# EAGLE design ESP_IRInterface (EAGLE 8.4.1)
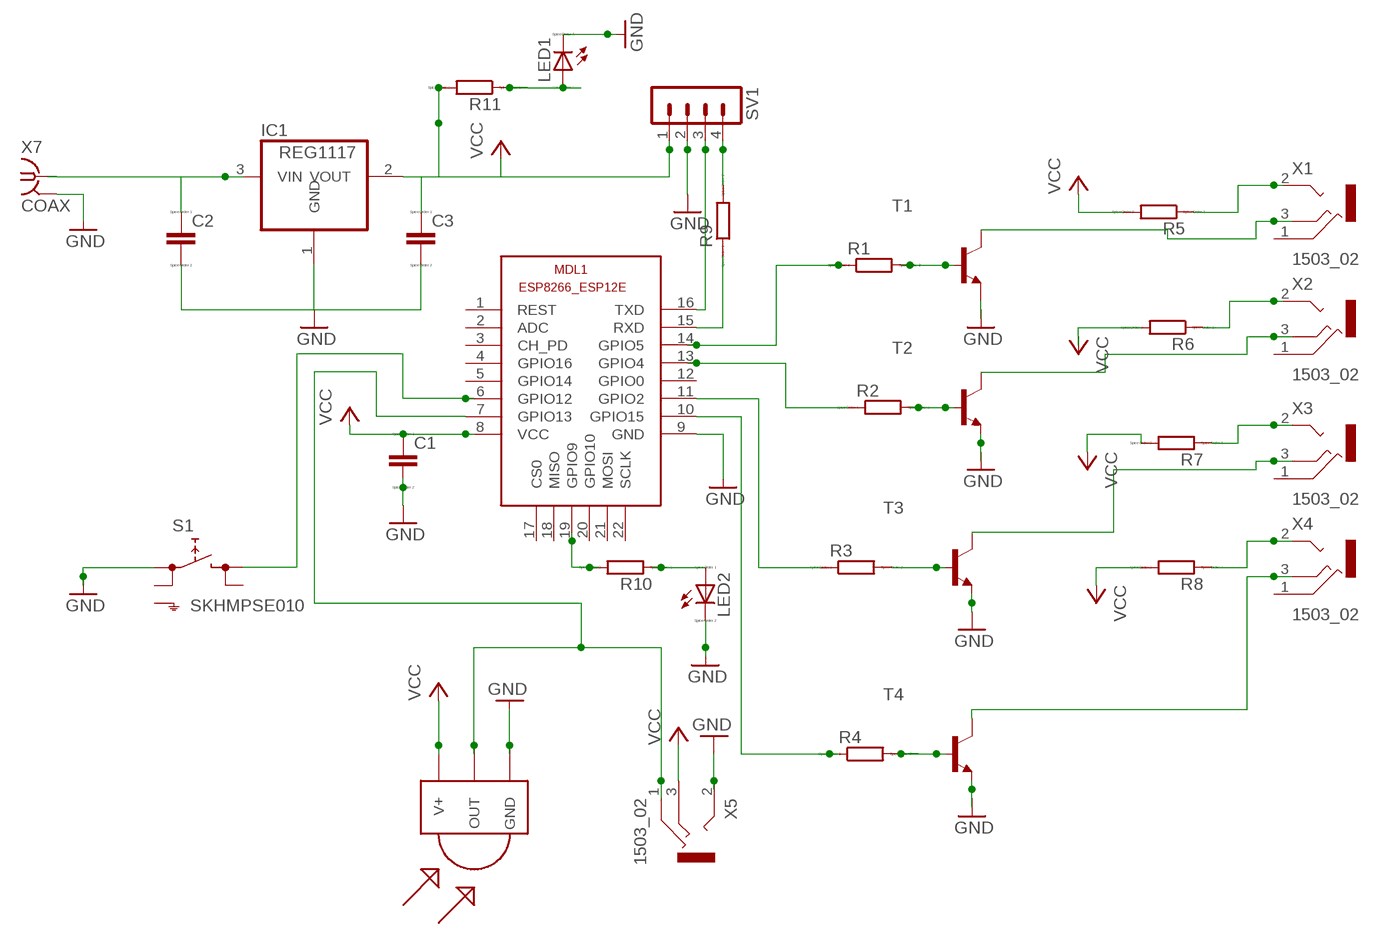
[diagram p0: schematic, sheet 1]

## Parts
C1  CC1206  [C1206]
C2  CC1206  [C1206]
C3  CC1206  [C1206]
IC1  REG1117  [SOT223]
LED1  LED_E  [LED_1206]
LED2  LED_E  [LED_1206]
MDL1  ESP8266-12EESP8266-ESP12E  [ESP8266-ESP12E]
R1  RR1206  [R1206]
R2  RR1206  [R1206]
R3  RR1206  [R1206]
R4  RR1206  [R1206]
R5  RR1206  [R1206]
R6  RR1206  [R1206]
R7  RR1206  [R1206]
R8  RR1206  [R1206]
R9  RR1206  [R1206]
R10  RR1206  [R1206]
R11  RR1206  [R1206]
S1  SKHMPSE010  [SKHMPXE010]
SV1  MA04-1  [MA04-1]
T1  MMBT2222ALT1-NPN-SOT23-BEC  [SOT23-BEC]
T2  MMBT2222ALT1-NPN-SOT23-BEC  [SOT23-BEC]
T3  MMBT2222ALT1-NPN-SOT23-BEC  [SOT23-BEC]
T4  MMBT2222ALT1-NPN-SOT23-BEC  [SOT23-BEC]
TSOP1  TSOP1730  [TSOP17XX]
X1  1503_02  [1503_02]
X2  1503_02  [1503_02]
X3  1503_02  [1503_02]
X4  1503_02  [1503_02]
X5  1503_02  [1503_02]
X7  COAX  [MMCX-J-P-X-ST-EM1-MKT]

## Nets
GND: C1.2 LED1.C LED2.C S1.1(1.1) SV1.2 T2.E T3.E X5.2
N$1: C2.2 C3.2 IC1.1(GND)
N$2: X7.2@1(GND)
N$3: MDL1.9(GND)
N$4: T1.E
N$5: T4.E
N$6: TSOP1.GND
N$7: MDL1.7(GPIO13) TSOP1.OUT X5.1
N$8: MDL1.15(RXD) R9.1
N$9: MDL1.10(GPIO15) R4.1
N$10: MDL1.11(GPIO2) R3.1
N$11: MDL1.13(GPIO4) R2.1
N$12: MDL1.14(GPIO5) R1.1
N$13: R1.2 T1.B
N$14: R2.2 T2.B
N$15: R3.2 T3.B
N$16: R4.2 T4.B
N$17: R5.1 X1.2
N$18: R6.1 X2.2
N$19: R7.1 X3.2 X3.2@2
N$20: R8.1 X4.2 X4.2@2
N$21: T1.C X1.3
N$22: T2.C X2.3
N$23: T3.C X3.3
N$24: T4.C X4.3
N$26: C2.1 IC1.3(VIN)
N$27: R9.2 SV1.4
N$28: MDL1.16(TXD) SV1.3
N$109: LED1.A R11.1
N$110: MDL1.6(GPIO12) S1.3(2.1)
N$111: MDL1.19(GPIO9) R10.2
N$112: LED2.A R10.1
VCC: C1.1 C3.1 IC1.2(VOUT) MDL1.8(VCC) R5.2 R7.2 R8.2 R11.2 SV1.1 TSOP1.V+ X5.3
Unconnected: MDL1.1(REST) MDL1.2(ADC) MDL1.3(CH_PD) MDL1.4(GPIO16) MDL1.5(GPIO14) MDL1.12(GPIO0) MDL1.17(CS0) MDL1.18(MISO) MDL1.20(GPIO10) MDL1.21(MOSI) MDL1.22(SCLK) R6.2 S1.2(1.2) S1.4(2.2) S1.5(SH) X1.1 X1.2@2 X2.1 X2.2@2 X3.1 X4.1 X5.2@2 X7.1

## Power pins joined to a net without a drawn wire
GND: X7.2@2(GND) X7.2@3(GND) X7.2@4(GND)

## Library data of the parts
C1-C3 = eagle-ltspice:C: CAPACITOR, European symbol; SPICEMODEL: NONE; SPICEPREFIX: C
IC1 = burr-brown:REG1117: 800mA and 1A Low Dropout (LDO) Positive Regulator 1.8V, 2.5V, 2.85V, 3.3V, 5V, and Adj; MPN: REG1117; OC_FARNELL: 1097566; OC_NEWARK: 14P6981
LED1 LED2 = eagle-ltspice:LED_E: LED Source: http://www.osram.convergy.de Source: www.luxeon.com Source: www.kingbright.com; SPICEMODEL: NONE; SPICEPREFIX: D; SPICETYPE: diode
MDL1 = ESP8266-ESP12E:ESP8266-12E: ESP8266-12E with additional I/O and GPIO04/05 corrected The author cannot warrant that this library is free from error or will meet your specific requirements. Created by PuceBaboon.com. Komagane, Nagano, JAPAN
R1-R11 = eagle-ltspice:R: RESISTOR, European symbol; SPICEMODEL: NONE; SPICEPREFIX: R
S1 = switch:SKHMP*E010: 6.2 X 6.5mm TACT Switch (SMD) Source: http://www3.alps.co.jp/WebObjects/catalog.woa/PDF/E/Switch/Tact/SKHM/SKHM.PDF
SV1 = con-lstb:MA04-1: PIN HEADER; OC_FARNELL: unknown; OC_NEWARK: unknown
T1-T4 = transistor:*-NPN-: NPN Transistror BF959 corrected 2008.03.06
TSOP1 = tsop:TSOP1730: IR Receiver and Demodulator
X1-X5 = con-lumberg:1503_02: Jack connectors according to JISC 6560, 3.5 mm Klinkeneinbaukupplung nach JISC 6560, 3,5 mm, 3-polig/stereo, abgewinkelte Ausführung, Surface-Mount-Technik (SMT) Source: http://www.lumberg.com/Produkte/PDFs/1503_02.pdf; OC_FARNELL: 1216979; OC_NEWARK: unknown
X7 = con-samtec:COAX: MMCX STRAIGHT, EDGE MOUNT JACK- 50 OHM Source: http://www.samtec.com/ftppub/cpdf/MMCX-J-P-X-ST-EM1-MKT.pdf; OC_FARNELL: unknown; OC_NEWARK: unknown

## Board
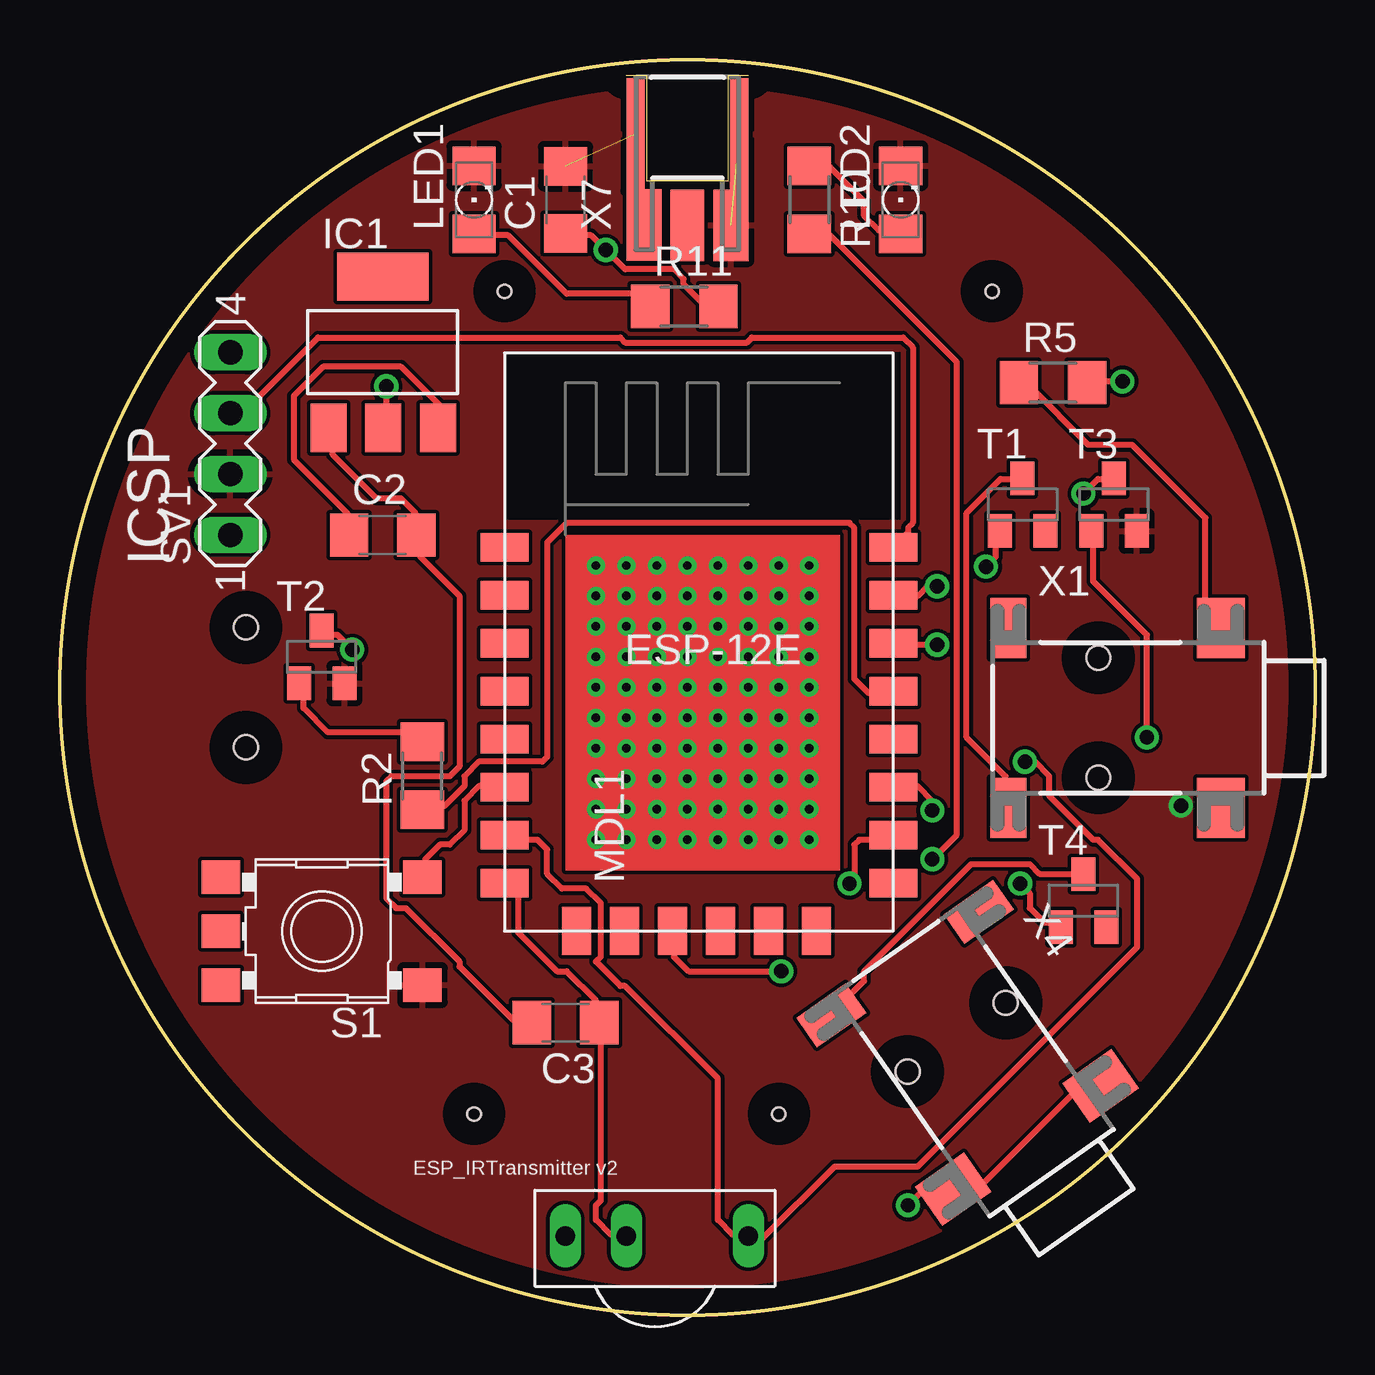
[diagram p1: board, top side]
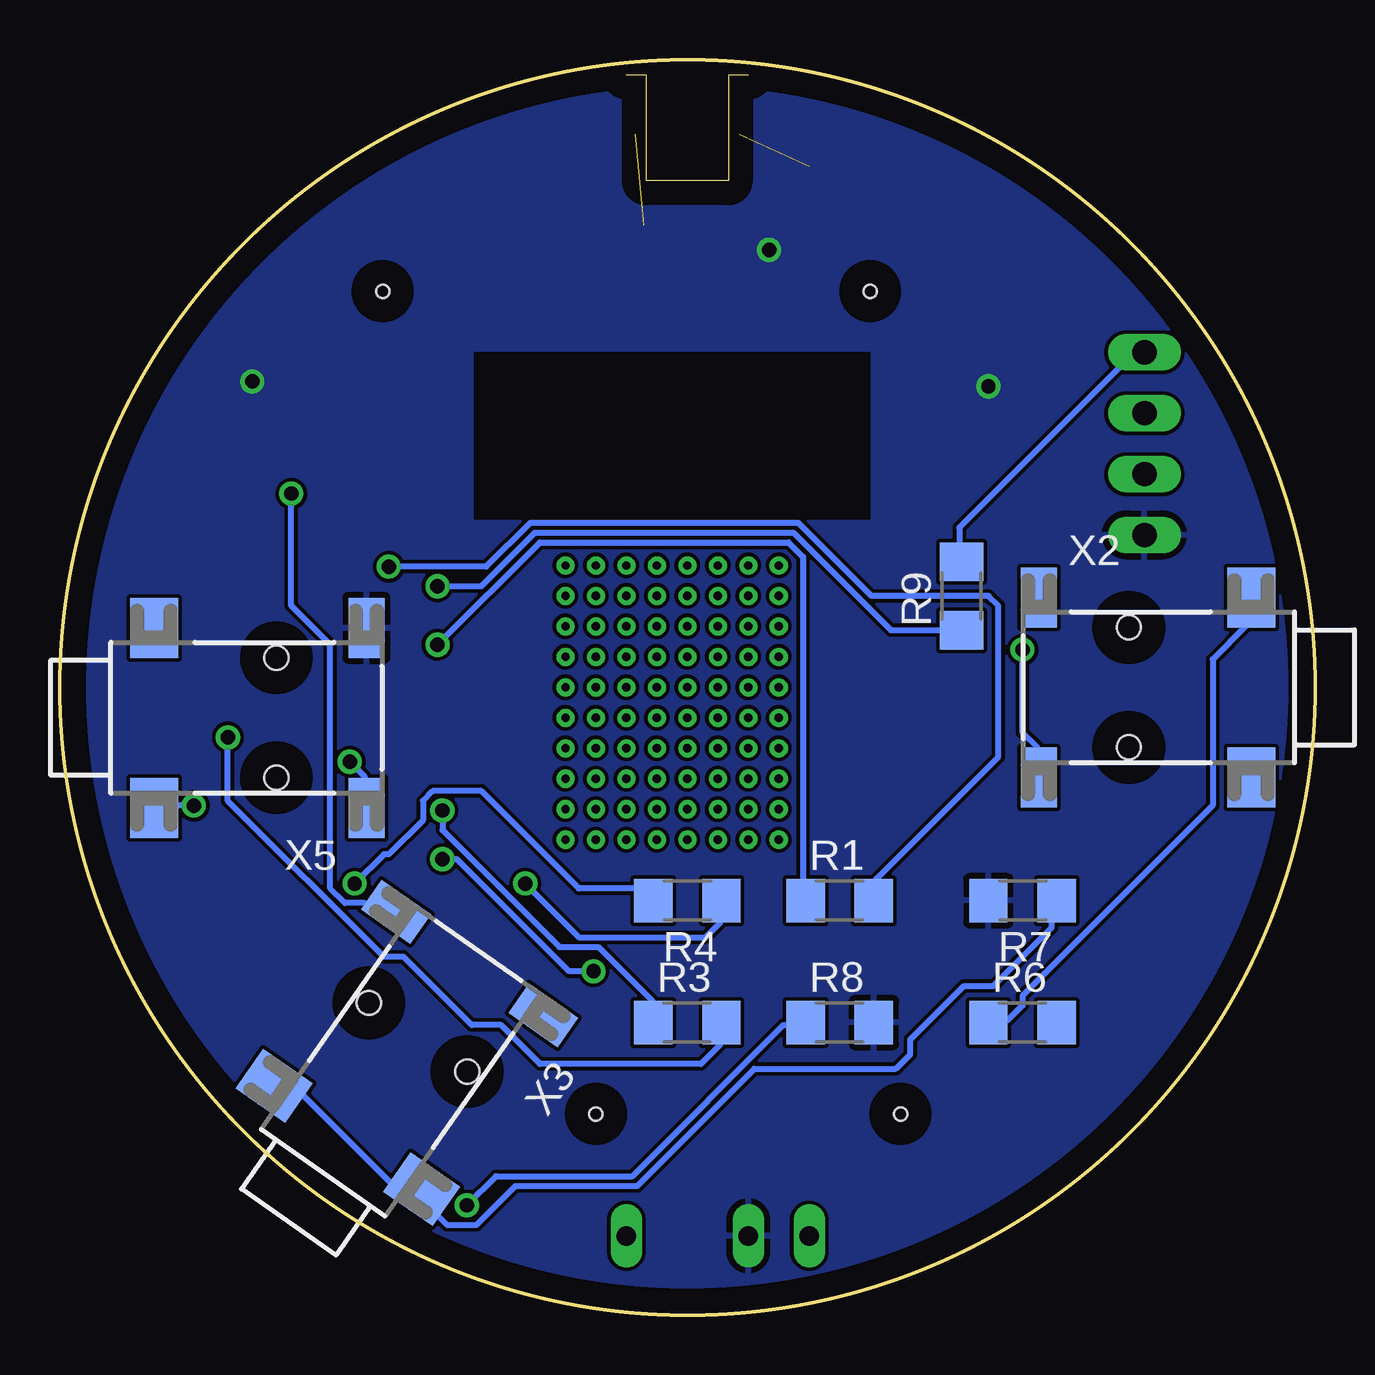
[diagram p2: board, bottom side, seen from below]

Size 52.3 x 52.3 mm. Coordinates in mm from the lower left corner, seen from the top.
Outline: circle at 26.15,26.15 radius 26.15
Copper layers (1*16): Top 0.035mm / dielectric 1.5mm / Bottom 0.035mm
Design rules "default *": minimum track width 10mil, minimum drill 0.6mm, track to track 6mil, track to pad 6mil, pad to pad 6mil, via to via 6mil, smd to smd 6mil, copper to edge 40mil, drill to drill 6mil, minimum pad ring 10mil, minimum via ring 8mil, stop-mask expansion 4mil, vias tented up to drill 0mil, thermal gap 10mil
Holes 0.55 mm at 18.53,42.66 38.85,42.66 17.26,8.37 29.96,8.37
tKeepout: area 21.1,18.5 to 32.5,32.5
tRestrict: area 21.1,18.5 to 32.5,32.5; area 21.1,18.5 to 32.5,32.5

### Footprints (pad centres in the part's own frame; a part is rotated, then mirrored left to right if it is on the bottom)
C1206 = smd 1.6 x 1.8: 1 -1.4,0; 2 1.4,0
SOT223 = smd 1.499 x 2.007: 1 -2.261,-3.15; 2 0.025,-3.15; 3 2.311,-3.15 | smd 3.81 x 2.007: 4 0,3.15
LED_1206 = smd 1.6 x 1.803: A -1.422,0; C 1.422,0
ESP8266-ESP12E = smd 2 x 1.2: 1 -7.62,5.84; 2 -7.62,3.84; 3 -7.62,1.84; 4 -7.62,-0.16; 5 -7.62,-2.16; 6 -7.62,-4.16; 7 -7.62,-6.16; 8 -7.62,-8.16; 9 8.58,-8.16; 10 8.58,-6.16; 11 8.58,-4.16; 12 8.58,-2.16; 13 8.58,-0.16; 14 8.58,1.84; 15 8.58,3.84; 16 8.58,5.84 | smd 1.2 x 2: 17 -4.62,-10.16; 18 -2.62,-10.16; 19 -0.62,-10.16; 20 1.38,-10.16; 21 3.38,-10.16; 22 5.38,-10.16
R1206 = smd 1.6 x 1.803: 1 -1.422,0; 2 1.422,0
SKHMPXE010 = smd 1.6 x 1.4: 1 -4.2,2.25; 2 4.2,2.25; 3 -4.2,-2.25; 4 4.2,-2.25; 5 4.2,0
MA04-1 = drill 1.016 long: 1 -3.81,0; 2 -1.27,0; 3 1.27,0; 4 3.81,0
SOT23-BEC = smd 1 x 1.4: B -0.95,-1.1; C 0,1.1; E 0.95,-1.1
TSOP17XX = drill 0.813 long: GND -3.81,0; OUT 3.81,0; V+ -1.27,0
1503_02 = smd 2.5 x 1.5: 1 -3.75,-10.75; 3 3.75,-10.75 | smd 2.5 x 2: 2 -3.75,-1.9; 2@2 3.75,-1.9 | hole 1: -2.5,-7; 2.5,-7
MMCX-J-P-X-ST-EM1-MKT = smd 1.4 x 2.975: 1 0,-6.15 | smd 1.46 x 2.975: 2@1 -1.812,-6.125; 2@2 1.812,-6.138 | smd 0.76 x 4.7: 2@3 -2.163,-2.35; 2@4 2.163,-2.35

### Placement (x,y rotation side)
C1  21.07,46.47 90 top
C2  13.45,32.5 0 top
C3  21.07,12.18 180 top
IC1  13.45,40.12 0 top
LED1  17.26,46.47 90 top
LED2  35.04,46.47 90 top
MDL1  26.15,26.15 0 top
R1  19.8,17.26 0 bottom
R2  15.1,22.47 90 top
R3  26.15,12.18 0 bottom
R4  26.15,17.26 180 bottom
R5  41.39,38.85 0 top
R6  12.18,12.18 0 bottom
R7  12.18,17.26 180 bottom
R8  19.8,12.18 0 bottom
R9  14.72,29.96 90 bottom
R10  31.23,46.47 270 top
R11  26.02,42.03 0 top
S1  10.91,15.99 180 top
SV1  7.1,36.31 90 top
T1  40.12,33.77 0 top
T2  10.91,27.42 0 top
T3  43.93,33.77 0 top
T4  42.66,17.26 0 top
TSOP1  24.88,3.29 0 top
X1  50.28,24.88 270 top
X2  0.75,26.15 270 bottom
X3  41.39,5.83 145 bottom
X4  41.39,5.83 215 top
X5  50.28,24.88 90 bottom
X7  26.15,51.55 0 top

### Tracks (layer width: path | path; a pad name or v marks a point on that pad's centre or on a via)
GND  (via drill 0.6)  (2 unrouted)
  Bottom 0.254: v46.72,21.22 48.35,21.22 X5.2
  pour Top: -15.76,64.25 74.41,64.25 74.41,-17.03 -15.76,-17.03
N$1
  Top 0.254: C3.2 19.5,12.28 18.89,12.28 16.65,14.52 16.65,14.72 14.42,16.96 14.01,16.96 13.6,17.36 13.6,22.24 13.81,22.44 16.24,22.44 16.65,22.85 16.65,29.96 15.03,31.59 15.03,32.4 C2.2 14.82,32.6 14.82,33.41 14.21,34.02 13.2,34.02 11.37,35.85 11.37,36.87 IC1.1
N$7  (via drill 0.6)
  Top 0.254: MDL1.7 18.68,19.8 19.9,19.8 20.31,19.39 20.31,18.38 20.92,17.77 21.93,17.77 22.54,17.16 22.54,14.92 22.34,14.72 23.36,13.7 23.56,13.7 27.42,9.84 27.42,3.95 28.03,3.34 28.64,3.34 TSOP1.OUT 28.84,3.14 29.25,3.14 32.3,6.19 35.75,6.19 44.9,15.33 44.9,18.17 43.27,19.8 43.07,19.8 41.24,21.63 41.24,22.44 40.63,23.05 v40.22,23.05
  Bottom 0.254: v40.22,23.05 39.61,22.44 39.61,21.22 X5.1
N$8  (via drill 0.6)
  Top 0.254: v36.56,30.37 36.16,30.37 35.75,29.96 34.74,29.96 MDL1.15
  Bottom 0.254: v36.56,30.37 34.74,30.37 32.5,32.6 21.73,32.6 17.67,28.54 14.82,28.54 R9.1
N$9  (via drill 0.6)
  Top 0.254: v32.91,17.97 33.11,18.17 33.11,19.6 33.31,19.8 34.53,19.8 MDL1.10
  Bottom 0.254: v32.91,17.97 30.67,15.74 25.39,15.74 24.78,16.35 24.78,17.16 R4.1
N$10  (via drill 0.6)
  Top 0.254: v36.36,21.02 36.36,21.43 35.75,22.04 34.74,22.04 MDL1.11
  Bottom 0.254: v36.36,21.02 36.36,20.21 31.48,15.33 29.86,15.33 27.62,13.09 27.62,12.28 R3.1
N$11
  Top 0.254: R2.1 15.23,21.22 16.04,21.22 16.85,22.04 16.85,22.44 17.46,23.05 20.11,23.05 20.31,23.25 20.31,32.2 21.12,33.01 32.91,33.01 33.11,32.81 33.11,26.51 33.72,25.9 34.53,25.9 MDL1.13
N$12  (via drill 0.6)
  Top 0.254: v36.56,27.93 34.74,27.93 MDL1.14
  Bottom 0.254: v36.56,27.93 32.3,32.2 21.93,32.2 21.32,31.59 21.32,17.36 R1.1
N$13  (via drill 0.6)
  Top 0.254: v38.6,31.18 39,31.59 39,32.6 T1.B
  Bottom 0.254: v38.6,31.18 34.53,31.18 32.7,33.01 21.53,33.01 18.48,29.96 13.6,29.96 13.2,29.55 13.2,23.25 18.28,18.17 18.28,17.36 R1.2
N$14
  Top 0.254: T2.B 10.15,26.3 10.15,25.29 11.16,24.27 14.82,24.27 15.03,24.07 R2.2
N$15  (via drill 0.6)
  Top 0.254: v45.3,24.07 45.3,28.33 43.07,30.57 43.07,32.6 T3.B
  Bottom 0.254: v45.3,24.07 45.3,21.43 38.8,14.92 37.99,14.92 35.14,12.08 33.92,12.08 32.3,10.45 25.59,10.45 24.78,11.27 24.78,12.08 R3.2
N$16  (via drill 0.6)
  Top 0.254: v40.02,17.97 40.43,17.57 40.43,16.96 41.03,16.35 41.64,16.35 T4.B
  Bottom 0.254: v40.02,17.97 38.8,19.19 38.6,19.19 37.17,20.61 37.17,21.43 36.77,21.83 34.74,21.83 30.67,17.77 28.03,17.77 27.62,17.36 R4.2
N$17
  Top 0.254: R5.1 40.02,38.7 40.43,38.7 42.86,36.26 44.69,36.26 47.74,33.21 47.74,29.35 48.35,28.74 X1.2
N$18
  Bottom 0.254: R6.1 13.4,12.28 12.79,12.28 12.18,12.89 12.18,13.3 4.26,21.22 4.26,27.32 2.83,28.74 2.83,29.76 X2.2
N$19
  Bottom 0.254: R7.1 10.96,17.16 10.96,16.14 13.4,13.7 14.62,13.7 16.85,11.47 16.85,10.86 17.46,10.25 23.36,10.25 28.23,5.37 33.31,5.37 34.94,3.75 36.16,3.75 37.17,4.76 37.17,5.17 X3.2 37.38,5.37 38.39,5.37 42.46,9.44 43.27,9.44 X3.2@2
N$20  (via drill 0.6)
  Top 0.254: v35.35,4.56 35.95,5.17 37.17,5.17 X4.2@2 37.38,5.37 38.39,5.37 42.46,9.44 43.27,9.44 X4.2
  Bottom 0.254: v35.35,4.56 34.13,5.78 28.44,5.78 22.14,12.08 21.32,12.08 R8.1
N$21
  Top 0.254: T1.C 40.02,34.84 39.21,34.84 37.78,33.41 37.78,24.07 39.41,22.44 39.41,21.22 X1.3
N$22  (via drill 0.6)
  Top 0.254: v12.18,27.73 11.57,28.33 10.96,28.33 T2.C
  Bottom 0.254: v12.18,27.73 12.18,24.27 11.57,23.66 11.57,22.44 X2.3
N$23  (via drill 0.6)
  Top 0.254: v42.66,34.23 43.27,34.84 43.88,34.84 T3.C
  Bottom 0.254: v42.66,34.23 42.66,29.55 41.03,27.93 41.03,17.77 40.43,17.16 39.61,17.16 39.41,16.96 38.39,16.96 X3.3
N$24
  Top 0.254: T4.C 42.66,18.38 40.83,18.38 40.43,18.78 37.99,18.78 33.52,14.31 33.52,13.91 32.3,12.69 X4.3
N$26
  Top 0.254: C2.1 11.98,32.6 11.98,33.41 9.74,35.65 9.74,38.29 10.96,39.51 14.21,39.51 15.84,37.89 15.84,37.07 IC1.3
N$27
  Bottom 0.254: SV1.4 7.51,40.12 14.82,32.81 14.82,31.38 R9.2
N$28
  Top 0.254: MDL1.16 35.35,32.6 35.35,32.81 35.55,33.01 35.55,40.32 35.14,40.73 28.84,40.73 28.64,40.53 23.56,40.53 23.36,40.73 10.76,40.73 7.71,37.68 7.1,37.68 SV1.3
N$29  (via drill 0.35)
  other vias: 22.34,31.23
N$30  (via drill 0.35)
  other vias: 23.61,31.23
N$31  (via drill 0.35)
  other vias: 24.88,31.23
N$32  (via drill 0.35)
  other vias: 26.15,31.23
N$33  (via drill 0.35)
  other vias: 27.42,31.23
N$34  (via drill 0.35)
  other vias: 28.69,31.23
N$35  (via drill 0.35)
  other vias: 29.96,31.23
N$36  (via drill 0.35)
  other vias: 31.23,31.23
N$37  (via drill 0.35)
  other vias: 22.34,29.96
N$38  (via drill 0.35)
  other vias: 23.61,29.96
N$39  (via drill 0.35)
  other vias: 24.88,29.96
N$40  (via drill 0.35)
  other vias: 26.15,29.96
N$41  (via drill 0.35)
  other vias: 27.42,29.96
N$42  (via drill 0.35)
  other vias: 28.69,29.96
N$43  (via drill 0.35)
  other vias: 29.96,29.96
N$44  (via drill 0.35)
  other vias: 31.23,29.96
N$45  (via drill 0.35)
  other vias: 22.34,28.69
N$46  (via drill 0.35)
  other vias: 23.61,28.69
N$47  (via drill 0.35)
  other vias: 24.88,28.69
N$48  (via drill 0.35)
  other vias: 26.15,28.69
N$49  (via drill 0.35)
  other vias: 27.42,28.69
N$50  (via drill 0.35)
  other vias: 28.69,28.69
N$51  (via drill 0.35)
  other vias: 29.96,28.69
N$52  (via drill 0.35)
  other vias: 31.23,28.69
N$53  (via drill 0.35)
  other vias: 22.34,27.42
N$54  (via drill 0.35)
  other vias: 23.61,27.42
N$55  (via drill 0.35)
  other vias: 24.88,27.42
N$56  (via drill 0.35)
  other vias: 26.15,27.42
N$57  (via drill 0.35)
  other vias: 27.42,27.42
N$58  (via drill 0.35)
  other vias: 28.69,27.42
N$59  (via drill 0.35)
  other vias: 29.96,27.42
N$60  (via drill 0.35)
  other vias: 31.23,27.42
N$61  (via drill 0.35)
  other vias: 22.34,26.15
N$62  (via drill 0.35)
  other vias: 23.61,26.15
N$63  (via drill 0.35)
  other vias: 24.88,26.15
N$64  (via drill 0.35)
  other vias: 26.15,26.15
N$65  (via drill 0.35)
  other vias: 27.42,26.15
N$66  (via drill 0.35)
  other vias: 28.69,26.15
N$67  (via drill 0.35)
  other vias: 29.96,26.15
N$68  (via drill 0.35)
  other vias: 31.23,26.15
N$69  (via drill 0.35)
  other vias: 22.34,24.88
N$70  (via drill 0.35)
  other vias: 23.61,24.88
N$71  (via drill 0.35)
  other vias: 24.88,24.88
N$72  (via drill 0.35)
  other vias: 26.15,24.88
N$73  (via drill 0.35)
  other vias: 27.42,24.88
N$74  (via drill 0.35)
  other vias: 28.69,24.88
N$75  (via drill 0.35)
  other vias: 29.96,24.88
N$76  (via drill 0.35)
  other vias: 31.23,24.88
N$77  (via drill 0.35)
  other vias: 22.34,23.61
N$78  (via drill 0.35)
  other vias: 23.61,23.61
N$79  (via drill 0.35)
  other vias: 24.88,23.61
N$80  (via drill 0.35)
  other vias: 26.15,23.61
N$81  (via drill 0.35)
  other vias: 27.42,23.61
N$82  (via drill 0.35)
  other vias: 28.69,23.61
N$83  (via drill 0.35)
  other vias: 29.96,23.61
N$84  (via drill 0.35)
  other vias: 31.23,23.61
N$85  (via drill 0.35)
  other vias: 31.23,22.34
N$86  (via drill 0.35)
  other vias: 29.96,22.34
N$87  (via drill 0.35)
  other vias: 28.69,22.34
N$88  (via drill 0.35)
  other vias: 27.42,22.34
N$89  (via drill 0.35)
  other vias: 26.15,22.34
N$90  (via drill 0.35)
  other vias: 24.88,22.34
N$91  (via drill 0.35)
  other vias: 23.61,22.34
N$92  (via drill 0.35)
  other vias: 22.34,22.34
N$93  (via drill 0.35)
  other vias: 22.34,21.07
N$94  (via drill 0.35)
  other vias: 23.61,21.07
N$95  (via drill 0.35)
  other vias: 24.88,21.07
N$96  (via drill 0.35)
  other vias: 26.15,21.07
N$97  (via drill 0.35)
  other vias: 27.42,21.07
N$98  (via drill 0.35)
  other vias: 28.69,21.07
N$99  (via drill 0.35)
  other vias: 29.96,21.07
N$100  (via drill 0.35)
  other vias: 31.23,21.07
N$101  (via drill 0.35)
  other vias: 31.23,19.8
N$102  (via drill 0.35)
  other vias: 29.96,19.8
N$103  (via drill 0.35)
  other vias: 28.69,19.8
N$104  (via drill 0.35)
  other vias: 27.42,19.8
N$105  (via drill 0.35)
  other vias: 26.15,19.8
N$106  (via drill 0.35)
  other vias: 24.88,19.8
N$107  (via drill 0.35)
  other vias: 23.61,19.8
N$108  (via drill 0.35)
  other vias: 22.34,19.8
N$109
  Top 0.254: LED1.A 17.26,45 18.68,45 21.12,42.56 24.17,42.56 24.58,42.15 R11.1
N$110
  Top 0.254: S1.3 15.23,18.38 15.23,18.99 15.84,19.6 16.24,19.6 16.85,20.21 16.85,21.43 17.46,22.04 18.48,22.04 MDL1.6
N$111  (via drill 0.6)
  Top 0.254: v36.36,18.99 37.38,20 37.38,39.71 32.09,45 31.28,45 R10.2 | v30.06,14.31 26.2,14.31 25.59,14.92 25.59,15.94 MDL1.19
  Bottom 0.254: v36.36,18.99 35.75,18.99 31.08,14.31 v30.06,14.31
N$112
  Top 0.254: R10.1 31.28,47.84 32.09,47.84 33.52,46.42 33.52,45.81 34.13,45.2 34.94,45.2 LED2.A
VCC  (via drill 0.6)
  Top 0.254: MDL1.8 18.68,17.97 19.09,17.57 19.09,15.94 20.71,14.31 21.12,14.31 22.34,13.09 22.34,12.28 C3.1 22.54,12.08 22.54,4.76 22.34,4.56 22.34,3.95 22.95,3.34 23.56,3.34 TSOP1.V+ | C1.1 21.12,45 22.14,45 v22.75,44.39 23.56,43.57 25.59,43.57 26,43.17 26,42.97 26.81,42.15 27.42,42.15 R11.2 | v44.29,38.9 42.86,38.9 R5.2 | v13.6,38.7 13.6,37.07 IC1.2
  pour Bottom: -15.76,64.25 74.41,64.25 74.41,-17.03 -15.76,-17.03
(copper drawn outside any net)
  shapes: Top area x1

### Text on the board
tPlace: ESP_IRTransmitter v2
tNames: ICSP